# Altium schematic sheet SmartCoin.SchDoc: SmartCoin
size A4; Date: 22.06.2025; Author: Vamsi Krishna Sesham; Revision: A; SheetNumber: 1; SheetTotal: 5
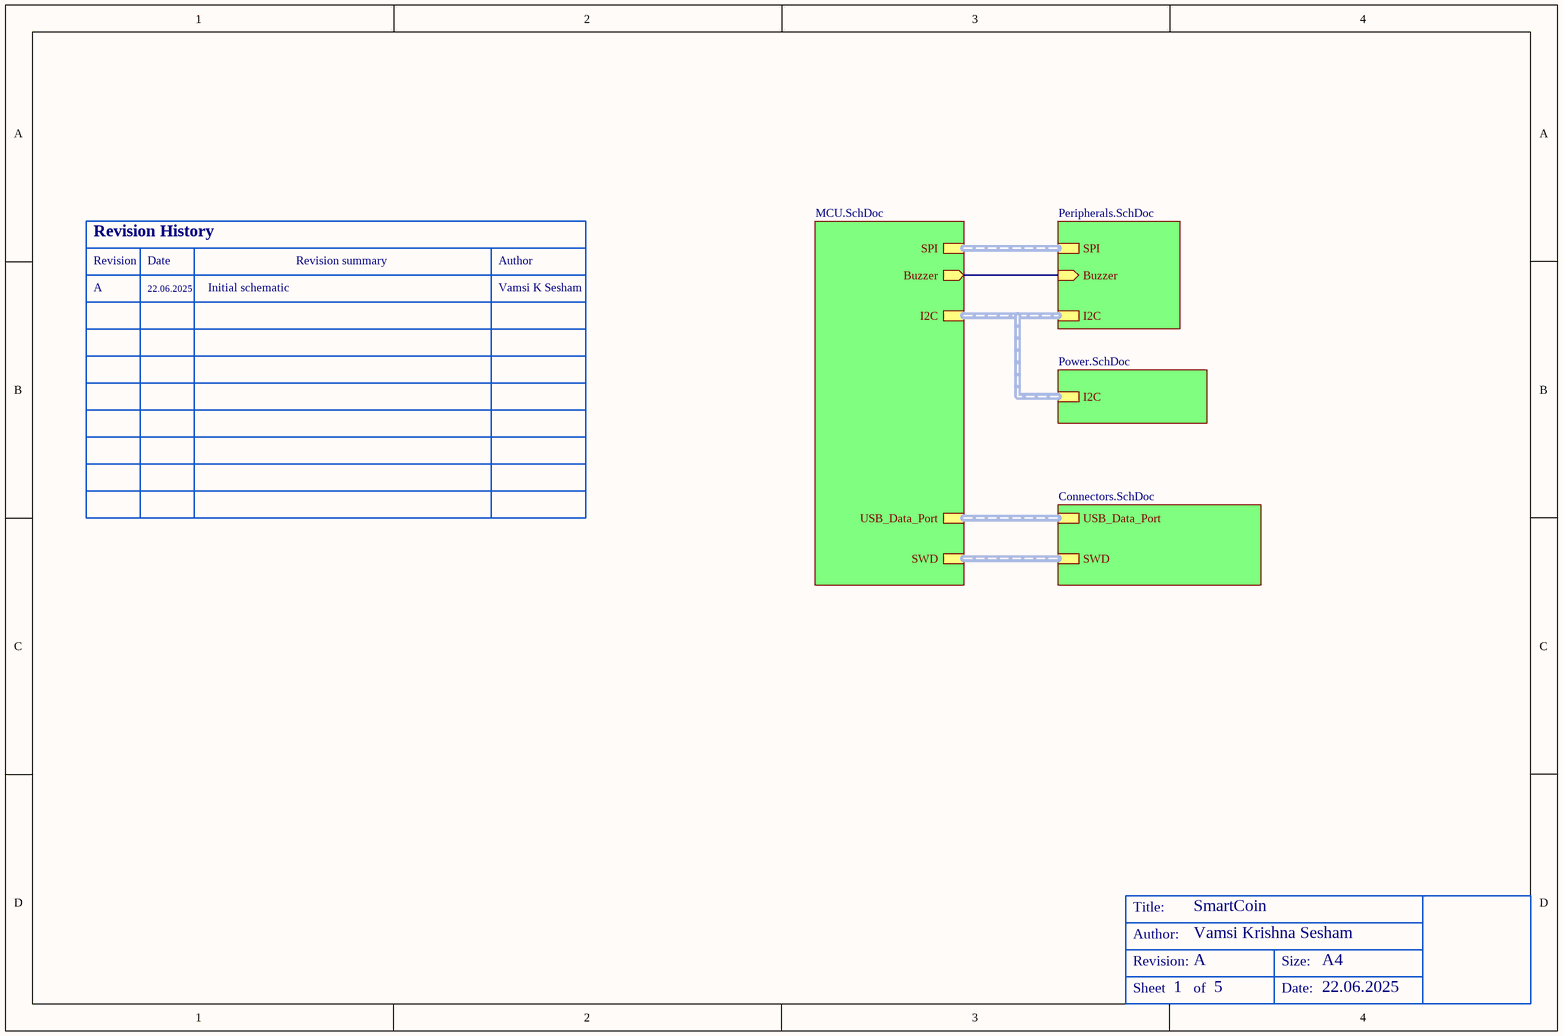
[diagram p0: SmartCoin.SchDoc]

## Parts
(Parts that share a designator on the sheet are numbered #1, #2 ... from top to bottom, then left to right.)
*#1  RevisionHistory  (value not drawn)  (graphical)
*#2  TitleBlock  (value not drawn)  (graphical)

## Sub-sheets
? = Peripherals.SchDoc: I2C (harness I2C), Buzzer (in), SPI (harness SPI_Flash)
? = MCU.SchDoc: USB_Data_Port (harness USB_Data), I2C (harness I2C), SWD (harness SWD Debug), Buzzer (out), SPI (harness SPI_Flash)
? = Connectors.SchDoc: USB_Data_Port (harness USB_Data), SWD (harness SWD Debug)
? = Power.SchDoc: I2C (harness I2C)

## Nets
(unnamed): sheet /Buzzer, sheet /Buzzer

## Notes on the sheet
- A
- 22.06.2025
- Initial schematic
- Vamsi K Sesham
- (in symbol RevisionHistory) Revision History; Revision; Date; Revision summary; Author
- (in symbol TitleBlock) Title:; Author:; Revision:; Size:; A4; Sheet; of; Date: